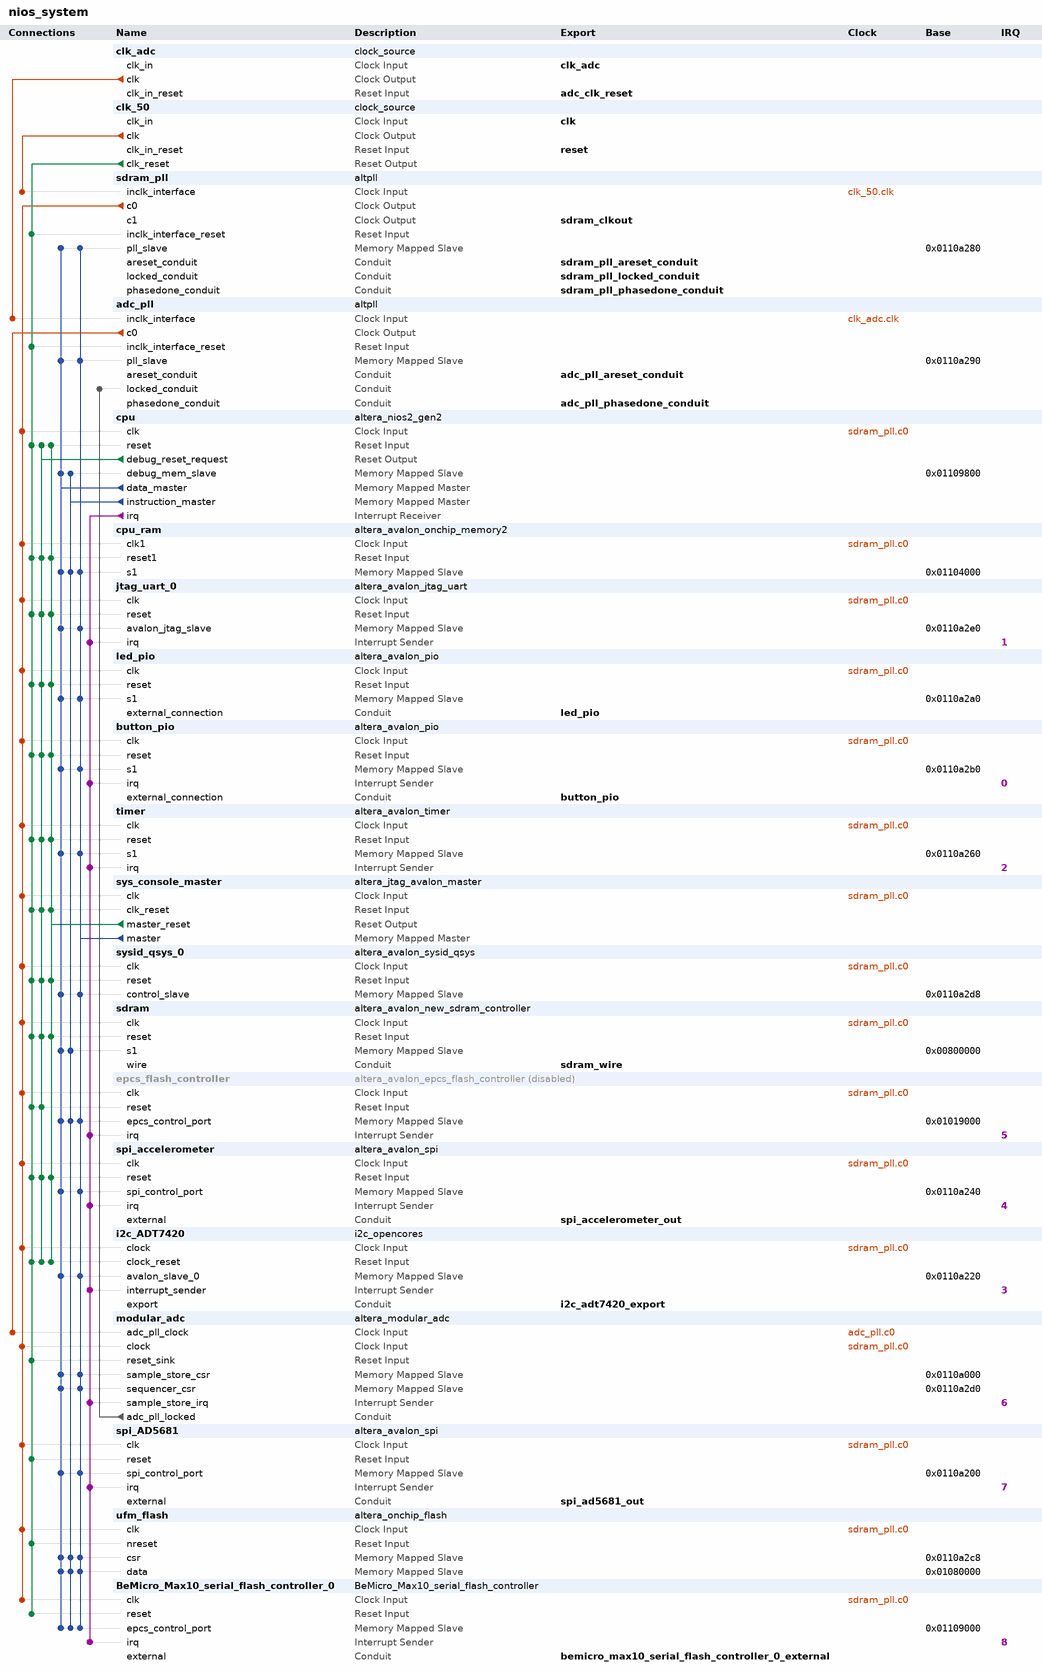
[diagram p0: system contents]
# Platform Designer (Qsys) system nios_system, MAX 10 10M08DAF484C8GES
# Parameters at their usual value, and those the tool derives, are not listed.
package require -exact qsys 14.1
create_system nios_system
set_project_property DEVICE_FAMILY {MAX 10}
set_project_property DEVICE 10M08DAF484C8GES

add_instance clk_adc clock_source 14.1
set_instance_parameter_value clk_adc clockFrequency 50000000

add_instance clk_50 clock_source 14.1
set_instance_parameter_value clk_50 clockFrequency 50000000

add_instance sdram_pll altpll 14.1
set_instance_parameter_value sdram_pll CLK0_DIVIDE_BY 1
set_instance_parameter_value sdram_pll CLK0_MULTIPLY_BY 1
set_instance_parameter_value sdram_pll CLK1_DIVIDE_BY 1
set_instance_parameter_value sdram_pll CLK1_DUTY_CYCLE 50
set_instance_parameter_value sdram_pll CLK1_MULTIPLY_BY 1
set_instance_parameter_value sdram_pll CLK1_PHASE_SHIFT -5000
set_instance_parameter_value sdram_pll INCLK0_INPUT_FREQUENCY 20000
set_instance_parameter_value sdram_pll PORT_ARESET PORT_USED
set_instance_parameter_value sdram_pll PORT_LOCKED PORT_UNUSED
set_instance_parameter_value sdram_pll PORT_clk1 PORT_USED
set_instance_parameter_value sdram_pll PORT_clk2 PORT_UNUSED
set_instance_parameter_value sdram_pll PORT_clk3 PORT_UNUSED

add_instance adc_pll altpll 14.1
set_instance_parameter_value adc_pll CLK0_DIVIDE_BY 5
set_instance_parameter_value adc_pll CLK0_MULTIPLY_BY 1
set_instance_parameter_value adc_pll INCLK0_INPUT_FREQUENCY 20000
set_instance_parameter_value adc_pll PORT_ARESET PORT_USED
set_instance_parameter_value adc_pll PORT_LOCKED PORT_USED
set_instance_parameter_value adc_pll PORT_clk1 PORT_UNUSED
set_instance_parameter_value adc_pll PORT_clk2 PORT_UNUSED
set_instance_parameter_value adc_pll PORT_clk3 PORT_UNUSED

add_instance cpu altera_nios2_gen2 14.1
set_instance_parameter_value cpu dcache_size 2048
set_instance_parameter_value cpu exceptionSlave cpu_ram.s1
set_instance_parameter_value cpu icache_size 4096
set_instance_parameter_value cpu impl Tiny
set_instance_parameter_value cpu resetSlave cpu_ram.s1

add_instance cpu_ram altera_avalon_onchip_memory2 14.1
set_instance_parameter_value cpu_ram dataWidth 32
set_instance_parameter_value cpu_ram dualPort false
set_instance_parameter_value cpu_ram initMemContent true
set_instance_parameter_value cpu_ram initializationFileName master_image/nios_system_cpu_ram.hex
set_instance_parameter_value cpu_ram memorySize 16384
set_instance_parameter_value cpu_ram useNonDefaultInitFile true

add_instance jtag_uart_0 altera_avalon_jtag_uart 14.1
set_instance_parameter_value jtag_uart_0 simInteractiveOptions NO_INTERACTIVE_WINDOWS

add_instance led_pio altera_avalon_pio 14.1
set_instance_parameter_value led_pio direction Output
set_instance_parameter_value led_pio width 8

add_instance button_pio altera_avalon_pio 14.1
set_instance_parameter_value button_pio captureEdge true
set_instance_parameter_value button_pio direction Input
set_instance_parameter_value button_pio generateIRQ true
set_instance_parameter_value button_pio irqType EDGE
set_instance_parameter_value button_pio width 4

add_instance timer altera_avalon_timer 14.1
set_instance_parameter_value timer period 1
set_instance_parameter_value timer periodUnits MSEC

add_instance sys_console_master altera_jtag_avalon_master 14.1

add_instance sysid_qsys_0 altera_avalon_sysid_qsys 14.1
set_instance_parameter_value sysid_qsys_0 id -1412623820

add_instance sdram altera_avalon_new_sdram_controller 14.1
set_instance_parameter_value sdram TAC 5.4
set_instance_parameter_value sdram TRCD 15.0
set_instance_parameter_value sdram TRP 15.0
set_instance_parameter_value sdram casLatency 2
set_instance_parameter_value sdram columnWidth 8
set_instance_parameter_value sdram dataWidth 16
set_instance_parameter_value sdram generateSimulationModel false
set_instance_parameter_value sdram model single_Micron_MT48LC4M32B2_7_chip
set_instance_parameter_value sdram numberOfBanks 4
set_instance_parameter_value sdram numberOfChipSelects 1
set_instance_parameter_value sdram powerUpDelay 100.0
set_instance_parameter_value sdram refreshPeriod 15.625
set_instance_parameter_value sdram rowWidth 12

add_instance epcs_flash_controller altera_avalon_epcs_flash_controller 14.1
set_instance_property epcs_flash_controller ENABLED false
set_instance_parameter_value epcs_flash_controller autoSelectASMIAtom false
set_instance_parameter_value epcs_flash_controller resetrequest_enabled true

add_instance spi_accelerometer altera_avalon_spi 14.1
set_instance_parameter_value spi_accelerometer clockPolarity 0
set_instance_parameter_value spi_accelerometer dataWidth 8
set_instance_parameter_value spi_accelerometer masterSPI true
set_instance_parameter_value spi_accelerometer numberOfSlaves 1
set_instance_parameter_value spi_accelerometer targetClockRate 2500000

add_instance i2c_ADT7420 i2c_opencores 13.0

add_instance modular_adc altera_modular_adc 14.1
set_instance_parameter_value modular_adc CLOCK_FREQ 50000000
set_instance_parameter_value modular_adc CORE_VAR 0
set_instance_parameter_value modular_adc DEVICE_PART 10M08DAF484C8GES
set_instance_parameter_value modular_adc clkdiv 2
set_instance_parameter_value modular_adc external_vref 2.48
set_instance_parameter_value modular_adc int_vref_vr 3.0
set_instance_parameter_value modular_adc refsel 0
set_instance_parameter_value modular_adc seq_order_length 17
set_instance_parameter_value modular_adc seq_order_slot_1 1
set_instance_parameter_value modular_adc seq_order_slot_10 10
set_instance_parameter_value modular_adc seq_order_slot_11 11
set_instance_parameter_value modular_adc seq_order_slot_12 12
set_instance_parameter_value modular_adc seq_order_slot_13 13
set_instance_parameter_value modular_adc seq_order_slot_14 14
set_instance_parameter_value modular_adc seq_order_slot_15 15
set_instance_parameter_value modular_adc seq_order_slot_16 16
set_instance_parameter_value modular_adc seq_order_slot_17 17
set_instance_parameter_value modular_adc seq_order_slot_2 2
set_instance_parameter_value modular_adc seq_order_slot_3 3
set_instance_parameter_value modular_adc seq_order_slot_4 4
set_instance_parameter_value modular_adc seq_order_slot_5 5
set_instance_parameter_value modular_adc seq_order_slot_6 6
set_instance_parameter_value modular_adc seq_order_slot_7 7
set_instance_parameter_value modular_adc seq_order_slot_8 8
set_instance_parameter_value modular_adc seq_order_slot_9 9
set_instance_parameter_value modular_adc tsclkdiv 1
set_instance_parameter_value modular_adc use_ch0 false
set_instance_parameter_value modular_adc use_ch10 true
set_instance_parameter_value modular_adc use_ch11 true
set_instance_parameter_value modular_adc use_ch12 true
set_instance_parameter_value modular_adc use_ch13 true
set_instance_parameter_value modular_adc use_ch14 true
set_instance_parameter_value modular_adc use_ch15 true
set_instance_parameter_value modular_adc use_ch16 true
set_instance_parameter_value modular_adc use_ch2 true
set_instance_parameter_value modular_adc use_ch3 true
set_instance_parameter_value modular_adc use_ch4 true
set_instance_parameter_value modular_adc use_ch5 true
set_instance_parameter_value modular_adc use_ch6 true
set_instance_parameter_value modular_adc use_ch7 true
set_instance_parameter_value modular_adc use_ch8 true
set_instance_parameter_value modular_adc use_ch9 true
set_instance_parameter_value modular_adc use_tsd true

add_instance spi_AD5681 altera_avalon_spi 14.1
set_instance_parameter_value spi_AD5681 clockPhase 1
set_instance_parameter_value spi_AD5681 clockPolarity 0
set_instance_parameter_value spi_AD5681 dataWidth 8
set_instance_parameter_value spi_AD5681 masterSPI true
set_instance_parameter_value spi_AD5681 numberOfSlaves 1
set_instance_parameter_value spi_AD5681 targetClockRate 5000000

add_instance ufm_flash altera_onchip_flash 14.1
set_instance_parameter_value ufm_flash CLOCK_FREQUENCY 50.0
set_instance_parameter_value ufm_flash CONFIGURATION_MODE {Single Uncompressed Image with Memory Initialization}
set_instance_parameter_value ufm_flash SECTOR_ACCESS_MODE {Read and write,Read and write,Read and write,Read and write,Read and write}
set_instance_parameter_value ufm_flash initFlashContent false
set_instance_parameter_value ufm_flash initializationFileName accelerometer_example.hex
set_instance_parameter_value ufm_flash initializationFileNameForSim accelerometer_example.dat
set_instance_parameter_value ufm_flash useNonDefaultInitFile false

add_instance BeMicro_Max10_serial_flash_controller_0 BeMicro_Max10_serial_flash_controller 14.0
set_instance_parameter_value BeMicro_Max10_serial_flash_controller_0 autoSelectASMIAtom false
set_instance_parameter_value BeMicro_Max10_serial_flash_controller_0 resetrequest_enabled true
set_instance_parameter_value BeMicro_Max10_serial_flash_controller_0 useASMIAtom false

# connections
add_connection adc_pll.c0 modular_adc.adc_pll_clock clock
add_connection clk_50.clk sdram_pll.inclk_interface clock
add_connection clk_adc.clk adc_pll.inclk_interface clock
add_connection sdram_pll.c0 BeMicro_Max10_serial_flash_controller_0.clk clock
add_connection sdram_pll.c0 button_pio.clk clock
add_connection sdram_pll.c0 cpu.clk clock
add_connection sdram_pll.c0 cpu_ram.clk1 clock
add_connection sdram_pll.c0 epcs_flash_controller.clk clock
add_connection sdram_pll.c0 i2c_ADT7420.clock clock
add_connection sdram_pll.c0 jtag_uart_0.clk clock
add_connection sdram_pll.c0 led_pio.clk clock
add_connection sdram_pll.c0 modular_adc.clock clock
add_connection sdram_pll.c0 sdram.clk clock
add_connection sdram_pll.c0 spi_accelerometer.clk clock
add_connection sdram_pll.c0 spi_AD5681.clk clock
add_connection sdram_pll.c0 sys_console_master.clk clock
add_connection sdram_pll.c0 sysid_qsys_0.clk clock
add_connection sdram_pll.c0 timer.clk clock
add_connection sdram_pll.c0 ufm_flash.clk clock
add_connection clk_50.clk_reset adc_pll.inclk_interface_reset reset
add_connection clk_50.clk_reset BeMicro_Max10_serial_flash_controller_0.reset reset
add_connection clk_50.clk_reset button_pio.reset reset
add_connection clk_50.clk_reset cpu.reset reset
add_connection clk_50.clk_reset cpu_ram.reset1 reset
add_connection clk_50.clk_reset epcs_flash_controller.reset reset
add_connection clk_50.clk_reset i2c_ADT7420.clock_reset reset
add_connection clk_50.clk_reset jtag_uart_0.reset reset
add_connection clk_50.clk_reset led_pio.reset reset
add_connection clk_50.clk_reset modular_adc.reset_sink reset
add_connection clk_50.clk_reset sdram.reset reset
add_connection clk_50.clk_reset sdram_pll.inclk_interface_reset reset
add_connection clk_50.clk_reset spi_accelerometer.reset reset
add_connection clk_50.clk_reset spi_AD5681.reset reset
add_connection clk_50.clk_reset sys_console_master.clk_reset reset
add_connection clk_50.clk_reset sysid_qsys_0.reset reset
add_connection clk_50.clk_reset timer.reset reset
add_connection clk_50.clk_reset ufm_flash.nreset reset
add_connection cpu.debug_reset_request button_pio.reset reset
add_connection cpu.debug_reset_request cpu.reset reset
add_connection cpu.debug_reset_request cpu_ram.reset1 reset
add_connection cpu.debug_reset_request epcs_flash_controller.reset reset
add_connection cpu.debug_reset_request i2c_ADT7420.clock_reset reset
add_connection cpu.debug_reset_request jtag_uart_0.reset reset
add_connection cpu.debug_reset_request led_pio.reset reset
add_connection cpu.debug_reset_request sdram.reset reset
add_connection cpu.debug_reset_request spi_accelerometer.reset reset
add_connection cpu.debug_reset_request sys_console_master.clk_reset reset
add_connection cpu.debug_reset_request sysid_qsys_0.reset reset
add_connection cpu.debug_reset_request timer.reset reset
add_connection sys_console_master.master_reset button_pio.reset reset
add_connection sys_console_master.master_reset cpu.reset reset
add_connection sys_console_master.master_reset cpu_ram.reset1 reset
add_connection sys_console_master.master_reset i2c_ADT7420.clock_reset reset
add_connection sys_console_master.master_reset jtag_uart_0.reset reset
add_connection sys_console_master.master_reset led_pio.reset reset
add_connection sys_console_master.master_reset sdram.reset reset
add_connection sys_console_master.master_reset spi_accelerometer.reset reset
add_connection sys_console_master.master_reset sys_console_master.clk_reset reset
add_connection sys_console_master.master_reset sysid_qsys_0.reset reset
add_connection sys_console_master.master_reset timer.reset reset
add_connection cpu.data_master adc_pll.pll_slave avalon
set_connection_parameter_value cpu.data_master/adc_pll.pll_slave baseAddress 0x0110a290
add_connection cpu.data_master BeMicro_Max10_serial_flash_controller_0.epcs_control_port avalon
set_connection_parameter_value cpu.data_master/BeMicro_Max10_serial_flash_controller_0.epcs_control_port baseAddress 0x01109000
add_connection cpu.data_master button_pio.s1 avalon
set_connection_parameter_value cpu.data_master/button_pio.s1 baseAddress 0x0110a2b0
add_connection cpu.data_master cpu.debug_mem_slave avalon
set_connection_parameter_value cpu.data_master/cpu.debug_mem_slave baseAddress 0x01109800
add_connection cpu.data_master cpu_ram.s1 avalon
set_connection_parameter_value cpu.data_master/cpu_ram.s1 baseAddress 0x01104000
add_connection cpu.data_master epcs_flash_controller.epcs_control_port avalon
set_connection_parameter_value cpu.data_master/epcs_flash_controller.epcs_control_port baseAddress 0x01019000
add_connection cpu.data_master i2c_ADT7420.avalon_slave_0 avalon
set_connection_parameter_value cpu.data_master/i2c_ADT7420.avalon_slave_0 baseAddress 0x0110a220
add_connection cpu.data_master jtag_uart_0.avalon_jtag_slave avalon
set_connection_parameter_value cpu.data_master/jtag_uart_0.avalon_jtag_slave baseAddress 0x0110a2e0
add_connection cpu.data_master led_pio.s1 avalon
set_connection_parameter_value cpu.data_master/led_pio.s1 baseAddress 0x0110a2a0
add_connection cpu.data_master modular_adc.sample_store_csr avalon
set_connection_parameter_value cpu.data_master/modular_adc.sample_store_csr baseAddress 0x0110a000
add_connection cpu.data_master modular_adc.sequencer_csr avalon
set_connection_parameter_value cpu.data_master/modular_adc.sequencer_csr baseAddress 0x0110a2d0
add_connection cpu.data_master sdram.s1 avalon
set_connection_parameter_value cpu.data_master/sdram.s1 baseAddress 0x00800000
add_connection cpu.data_master sdram_pll.pll_slave avalon
set_connection_parameter_value cpu.data_master/sdram_pll.pll_slave baseAddress 0x0110a280
add_connection cpu.data_master spi_accelerometer.spi_control_port avalon
set_connection_parameter_value cpu.data_master/spi_accelerometer.spi_control_port baseAddress 0x0110a240
add_connection cpu.data_master spi_AD5681.spi_control_port avalon
set_connection_parameter_value cpu.data_master/spi_AD5681.spi_control_port baseAddress 0x0110a200
add_connection cpu.data_master sysid_qsys_0.control_slave avalon
set_connection_parameter_value cpu.data_master/sysid_qsys_0.control_slave baseAddress 0x0110a2d8
add_connection cpu.data_master timer.s1 avalon
set_connection_parameter_value cpu.data_master/timer.s1 baseAddress 0x0110a260
add_connection cpu.data_master ufm_flash.csr avalon
set_connection_parameter_value cpu.data_master/ufm_flash.csr baseAddress 0x0110a2c8
add_connection cpu.data_master ufm_flash.data avalon
set_connection_parameter_value cpu.data_master/ufm_flash.data baseAddress 0x01080000
add_connection cpu.instruction_master BeMicro_Max10_serial_flash_controller_0.epcs_control_port avalon
set_connection_parameter_value cpu.instruction_master/BeMicro_Max10_serial_flash_controller_0.epcs_control_port baseAddress 0x01109000
add_connection cpu.instruction_master cpu.debug_mem_slave avalon
set_connection_parameter_value cpu.instruction_master/cpu.debug_mem_slave baseAddress 0x01109800
add_connection cpu.instruction_master cpu_ram.s1 avalon
set_connection_parameter_value cpu.instruction_master/cpu_ram.s1 baseAddress 0x01104000
add_connection cpu.instruction_master epcs_flash_controller.epcs_control_port avalon
set_connection_parameter_value cpu.instruction_master/epcs_flash_controller.epcs_control_port baseAddress 0x01019000
add_connection cpu.instruction_master sdram.s1 avalon
set_connection_parameter_value cpu.instruction_master/sdram.s1 baseAddress 0x00800000
add_connection cpu.instruction_master ufm_flash.csr avalon
set_connection_parameter_value cpu.instruction_master/ufm_flash.csr baseAddress 0x0110a2c8
add_connection cpu.instruction_master ufm_flash.data avalon
set_connection_parameter_value cpu.instruction_master/ufm_flash.data baseAddress 0x01080000
add_connection sys_console_master.master adc_pll.pll_slave avalon
set_connection_parameter_value sys_console_master.master/adc_pll.pll_slave baseAddress 0x0110a290
add_connection sys_console_master.master BeMicro_Max10_serial_flash_controller_0.epcs_control_port avalon
set_connection_parameter_value sys_console_master.master/BeMicro_Max10_serial_flash_controller_0.epcs_control_port baseAddress 0x01109000
add_connection sys_console_master.master button_pio.s1 avalon
set_connection_parameter_value sys_console_master.master/button_pio.s1 baseAddress 0x0110a2b0
add_connection sys_console_master.master cpu_ram.s1 avalon
set_connection_parameter_value sys_console_master.master/cpu_ram.s1 baseAddress 0x01104000
add_connection sys_console_master.master epcs_flash_controller.epcs_control_port avalon
set_connection_parameter_value sys_console_master.master/epcs_flash_controller.epcs_control_port baseAddress 0x01019000
add_connection sys_console_master.master i2c_ADT7420.avalon_slave_0 avalon
set_connection_parameter_value sys_console_master.master/i2c_ADT7420.avalon_slave_0 baseAddress 0x0110a220
add_connection sys_console_master.master jtag_uart_0.avalon_jtag_slave avalon
set_connection_parameter_value sys_console_master.master/jtag_uart_0.avalon_jtag_slave baseAddress 0x0110a2e0
add_connection sys_console_master.master led_pio.s1 avalon
set_connection_parameter_value sys_console_master.master/led_pio.s1 baseAddress 0x0110a2a0
add_connection sys_console_master.master modular_adc.sample_store_csr avalon
set_connection_parameter_value sys_console_master.master/modular_adc.sample_store_csr baseAddress 0x0110a000
add_connection sys_console_master.master modular_adc.sequencer_csr avalon
set_connection_parameter_value sys_console_master.master/modular_adc.sequencer_csr baseAddress 0x0110a2d0
add_connection sys_console_master.master sdram_pll.pll_slave avalon
set_connection_parameter_value sys_console_master.master/sdram_pll.pll_slave baseAddress 0x0110a280
add_connection sys_console_master.master spi_accelerometer.spi_control_port avalon
set_connection_parameter_value sys_console_master.master/spi_accelerometer.spi_control_port baseAddress 0x0110a240
add_connection sys_console_master.master spi_AD5681.spi_control_port avalon
set_connection_parameter_value sys_console_master.master/spi_AD5681.spi_control_port baseAddress 0x0110a200
add_connection sys_console_master.master sysid_qsys_0.control_slave avalon
set_connection_parameter_value sys_console_master.master/sysid_qsys_0.control_slave baseAddress 0x0110a2d8
add_connection sys_console_master.master timer.s1 avalon
set_connection_parameter_value sys_console_master.master/timer.s1 baseAddress 0x0110a260
add_connection sys_console_master.master ufm_flash.csr avalon
set_connection_parameter_value sys_console_master.master/ufm_flash.csr baseAddress 0x0110a2c8
add_connection sys_console_master.master ufm_flash.data avalon
set_connection_parameter_value sys_console_master.master/ufm_flash.data baseAddress 0x01080000
add_connection modular_adc.adc_pll_locked adc_pll.locked_conduit conduit
add_connection cpu.irq BeMicro_Max10_serial_flash_controller_0.irq interrupt
set_connection_parameter_value cpu.irq/BeMicro_Max10_serial_flash_controller_0.irq irqNumber 8
add_connection cpu.irq button_pio.irq interrupt
set_connection_parameter_value cpu.irq/button_pio.irq irqNumber 0
add_connection cpu.irq epcs_flash_controller.irq interrupt
set_connection_parameter_value cpu.irq/epcs_flash_controller.irq irqNumber 5
add_connection cpu.irq i2c_ADT7420.interrupt_sender interrupt
set_connection_parameter_value cpu.irq/i2c_ADT7420.interrupt_sender irqNumber 3
add_connection cpu.irq jtag_uart_0.irq interrupt
set_connection_parameter_value cpu.irq/jtag_uart_0.irq irqNumber 1
add_connection cpu.irq modular_adc.sample_store_irq interrupt
set_connection_parameter_value cpu.irq/modular_adc.sample_store_irq irqNumber 6
add_connection cpu.irq spi_accelerometer.irq interrupt
set_connection_parameter_value cpu.irq/spi_accelerometer.irq irqNumber 4
add_connection cpu.irq spi_AD5681.irq interrupt
set_connection_parameter_value cpu.irq/spi_AD5681.irq irqNumber 7
add_connection cpu.irq timer.irq interrupt
set_connection_parameter_value cpu.irq/timer.irq irqNumber 2

# exported interfaces
add_interface adc_clk_reset reset sink
set_interface_property adc_clk_reset EXPORT_OF clk_adc.clk_in_reset
add_interface adc_pll_areset_conduit conduit end
set_interface_property adc_pll_areset_conduit EXPORT_OF adc_pll.areset_conduit
add_interface adc_pll_phasedone_conduit conduit end
set_interface_property adc_pll_phasedone_conduit EXPORT_OF adc_pll.phasedone_conduit
add_interface bemicro_max10_serial_flash_controller_0_external conduit end
set_interface_property bemicro_max10_serial_flash_controller_0_external EXPORT_OF BeMicro_Max10_serial_flash_controller_0.external
add_interface button_pio conduit end
set_interface_property button_pio EXPORT_OF button_pio.external_connection
add_interface clk clock sink
set_interface_property clk EXPORT_OF clk_50.clk_in
add_interface clk_adc clock sink
set_interface_property clk_adc EXPORT_OF clk_adc.clk_in
add_interface i2c_adt7420_export conduit end
set_interface_property i2c_adt7420_export EXPORT_OF i2c_ADT7420.export
add_interface led_pio conduit end
set_interface_property led_pio EXPORT_OF led_pio.external_connection
add_interface reset reset sink
set_interface_property reset EXPORT_OF clk_50.clk_in_reset
add_interface sdram_clkout clock source
set_interface_property sdram_clkout EXPORT_OF sdram_pll.c1
add_interface sdram_pll_areset_conduit conduit end
set_interface_property sdram_pll_areset_conduit EXPORT_OF sdram_pll.areset_conduit
add_interface sdram_pll_locked_conduit conduit end
set_interface_property sdram_pll_locked_conduit EXPORT_OF sdram_pll.locked_conduit
add_interface sdram_pll_phasedone_conduit conduit end
set_interface_property sdram_pll_phasedone_conduit EXPORT_OF sdram_pll.phasedone_conduit
add_interface sdram_wire conduit end
set_interface_property sdram_wire EXPORT_OF sdram.wire
add_interface spi_accelerometer_out conduit end
set_interface_property spi_accelerometer_out EXPORT_OF spi_accelerometer.external
add_interface spi_ad5681_out conduit end
set_interface_property spi_ad5681_out EXPORT_OF spi_AD5681.external

set_interconnect_requirement {$system} qsys_mm.clockCrossingAdapter HANDSHAKE
set_interconnect_requirement {$system} qsys_mm.insertDefaultSlave FALSE
set_interconnect_requirement {$system} qsys_mm.maxAdditionalLatency 1

save_system nios_system.qsys
